# EAGLE schematic Possible board Schematic (EAGLE 9.6.2)
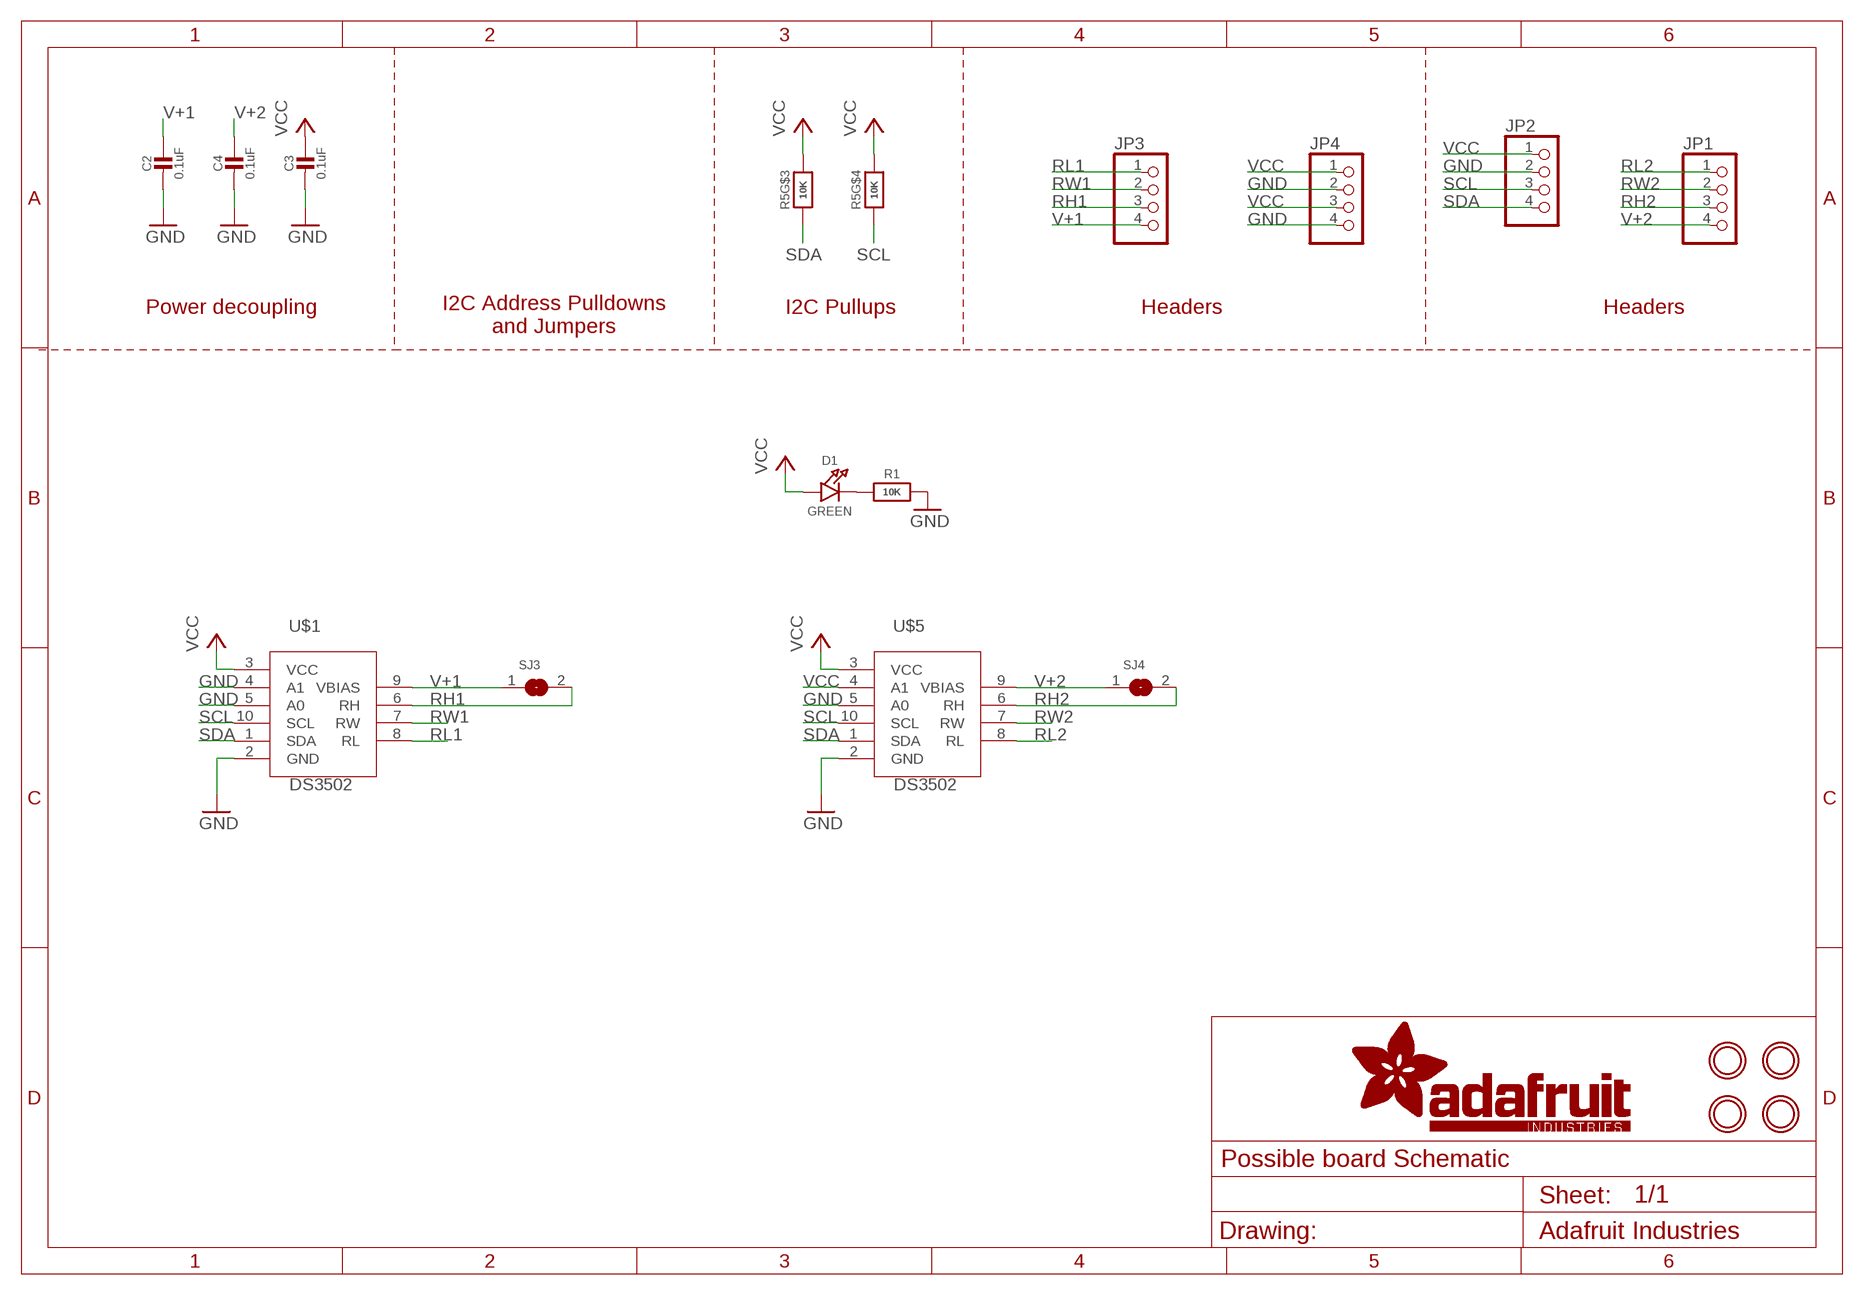
[diagram p0: schematic, sheet 1]

## Parts
C2  0.1uF  CAP_CERAMIC0603_NO  [0603-NO]
C3  0.1uF  CAP_CERAMIC0603_NO  [0603-NO]
C4  0.1uF  CAP_CERAMIC0603_NO  [0603-NO]
D1  GREEN  LED0603_NOOUTLINE  [CHIPLED_0603_NOOUTLINE]
JP1  HEADER-1X4ROUND  [1X04_ROUND]
JP2  HEADER-1X4ROUND  [1X04_ROUND]
JP3  HEADER-1X4ROUND  [1X04_ROUND]
JP4  HEADER-1X4ROUND  [1X04_ROUND]
R1  10K  RESISTOR_0603_NOOUT  [0603-NO]
R5  10K  RESISTOR_4PACK  [RESPACK_4X0603]
SJ3  SOLDERJUMPERCLOSED  [SOLDERJUMPER_CLOSEDWIRE]
SJ4  SOLDERJUMPERCLOSED  [SOLDERJUMPER_CLOSEDWIRE]
U$1  DS3502  [MSOP10]
U$2  MOUNTINGHOLE2.5  [MOUNTINGHOLE_2.5_PLATED]
U$3  MOUNTINGHOLE2.5  [MOUNTINGHOLE_2.5_PLATED]
U$5  DS3502  [MSOP10]
U$6  MOUNTINGHOLE2.5  [MOUNTINGHOLE_2.5_PLATED]
U$7  MOUNTINGHOLE2.5  [MOUNTINGHOLE_2.5_PLATED]

## Nets
GND: C2.2 C3.2 C4.2 JP2.2 JP4.2 JP4.4 R1.2 U$1.2(GND) U$1.4(A1) U$1.5(A0) U$5.2(GND) U$5.5(A0)
N$2: D1.C R1.1
RH1: JP3.3 SJ3.2 U$1.6(RH)
RH2: JP1.3 SJ4.2 U$5.6(RH)
RL1: JP3.1 U$1.8(RL)
RL2: JP1.1 U$5.8(RL)
RW1: JP3.2 U$1.7(RW)
RW2: JP1.2 U$5.7(RW)
SCL: JP2.3 R5.4 U$1.10(SCL) U$5.10(SCL)
SDA: JP2.4 R5.3 U$1.1(SDA) U$5.1(SDA)
V+1: C2.1 JP3.4 SJ3.1 U$1.9(VBIAS)
V+2: C4.1 JP1.4 SJ4.1 U$5.9(VBIAS)
VCC: C3.1 D1.A JP2.1 JP4.1 JP4.3 R5.5 R5.6 U$1.3(VCC) U$5.3(VCC) U$5.4(A1)
Unconnected: R5.1 R5.2 R5.7 R5.8

## Notes on the sheet
- Power decoupling
- I2C Address Pulldowns
  and Jumpers
- I2C Pullups | Headers | Headers

## Library data of the parts
C2-C4 = microbuilder:CAP_CERAMIC: Ceramic Capacitors For new designs, use the packages preceded by an '_' character since they are more reliable: The following footprints should be used on most boards: _0402 - Standard footprint for regular board layouts _0603 - Standard footprint for regular board layouts _0805 - Standard footprint for regular board layouts _1206 - Standard footprint for regular board layouts For extremely tight-pitch boards where space is at a premium, the following 'micro-pitch' footprints can be used (smaller pads, no silkscreen outline, etc.): _0402MP - Micro-pitch footprint for very dense/compact boards _0603MP - Micro-pitch footprint for very dense/compact boards _0805MP - Micro-pitch footprint for very dense/compact boards _1206MP - Micro-pitch footprint for very dense/compact boards
D1 = microbuilder:LED: LED 0603 - 0603 Surface Mount Package 2mA: Green LED - Low Power (3.9mcd, 2ma, 1.7Vf) - Digikey: 475-2709-2-ND Orange LED - Low Power (9.8mcd, 2ma, 1.8Vf) - Digikey: 475-1194-2-ND Red LED - Low Power (5mcd, 2ma, 1.8Vf) - Digikey: 475-1195-2-ND Yellow LED - Low Power (7mcd, 2ma, 1.8Vf) - Digikey: 475-1196-2-ND 5mA: Blue LED - Low Power (17mcd, 5ma, 2.9Vf) - Digikey: LNJ937W8CRACT-ND 0805 - 0805 Surface Mount Package 2mA: Red LED (8.8mcd, 2mA, 1.8Vf, Clear) - Low Power [Digikey: 475-2510-1-ND] Green LED (5mcd, 2mA, 1.8Vf, Clear) - Low Power [Digikey: 475-2730-1-ND] Yellow LED (11.3mcd, 2mA, 1.8Vf, Clear) - Low Power [Digikey: 475-2555-1-ND] 20mA: Red LED (104mcd, 20mA, Diffused) - LS R976 [Digikey: 475-1278-6-ND] Red LED (12mcd, 20mA, 2.0Vf, Clear) - APT2012EC [Digikey: 754-1128-1-ND] Green LED (15mcd, 20mA, 2.2Vf, Clear) - APT2012GC [Digikey: 754-1131-1-ND] Orange LED (160mcd, 20mA, 2.1Vf, Clear) - APT2012SECK [Digikey: 754-1130-1-ND] 1206 - 1206 Surface Mount Package Green LED (26mcd, 20mA, Diffused) - LG N971 [Digikey: 475-1407-6-ND] Red LED (15mcd, 20mA, Diffused) - LH N974 [Digikey: 475-1416-6-ND] Cree - Cree High-Power Surface Mount LEDs XPEBWT-L1-0000-00D50 - White 111lm 350mA 2.9Vf 6200K 110° XTEAWT-00-0000-00000LEE3 - White 114lm 350mA 2.85Vf 5000K 115° Everlight - Everlight 45-21 Series Surface Mount LEDs 45-21/QK2C-B2832AC2CB2/2T - Warm White 2000mcd 20mA 3.25Vf 3050K 120° 45-21/LK2C-B38452C4CB2/2T - Nuetral White 2000mcd 20mA 3.25Vf 4150K 120° 45-21/LK2C-B50634C6CB2/2T - Cold White 2200mcd 20mA 3.25Vf 5650K 120° PLCC2 Reverse Mount LS T77K-J1L2-1-0-2-R18-Z - Red 11.25mcd 2mA 1.8Vf 630nm 120° LO T77K-L1M2-24-Z - Orange 19.6mcd 2mA 1.8Vf 606nm 120° LY T77K-K2M1-26-Z - Yellow 15.7mcd 2mA 1.8Vf 587nm 120°
JP1-JP4 = microbuilder:HEADER-1X4: PIN HEADER
R1 = microbuilder:RESISTOR: Resistors For new designs, use the packages preceded by an '_' character since they are more reliable: The following footprints should be used on most boards: _0402 - Standard footprint for regular board layouts _0603 - Standard footprint for regular board layouts _0805 - Standard footprint for regular board layouts _1206 - Standard footprint for regular board layouts For extremely tight-pitch boards where space is at a premium, the following 'micro-pitch' footprints can be used (smaller pads, no silkscreen outline, etc.): _0402MP - Micro-pitch footprint for very dense/compact boards _0603MP - Micro-pitch footprint for very dense/compact boards _0805MP - Micro-pitch footprint for very dense/compact boards _1206MP - Micro-pitch footprint for very dense/compact boards
R5 = microbuilder:RESISTOR_4PACK: Resistor Packs (4 resistors) 4 x 0603 10K 1/16W - Digikey: YC164J-10KCT-ND
SJ3 SJ4 = microbuilder:SOLDERJUMPER: SMD Solder JUMPER Solder the two pads together to create a connection, or remove the solder to break it. REFLOW - Use this footprint for solder paste and reflow ovens. WAVE - Use this footprint for hand-soldering (larger pads). CLOSED - Has a trace between the two pads to ensure it is closed by default. The trace needs to be cut to disable the jumper, and can be closed again by creating a solder bridge between the two pads.
U$1 U$5 = microbuilder:DS3502
U$2 U$3 U$6 U$7 = microbuilder:MOUNTINGHOLE: Mounting Hole For #2 screws (0.086"/2.18mm width, 0.094"/2.4mm hole) use 2.5mm; BOM: EXCLUDE